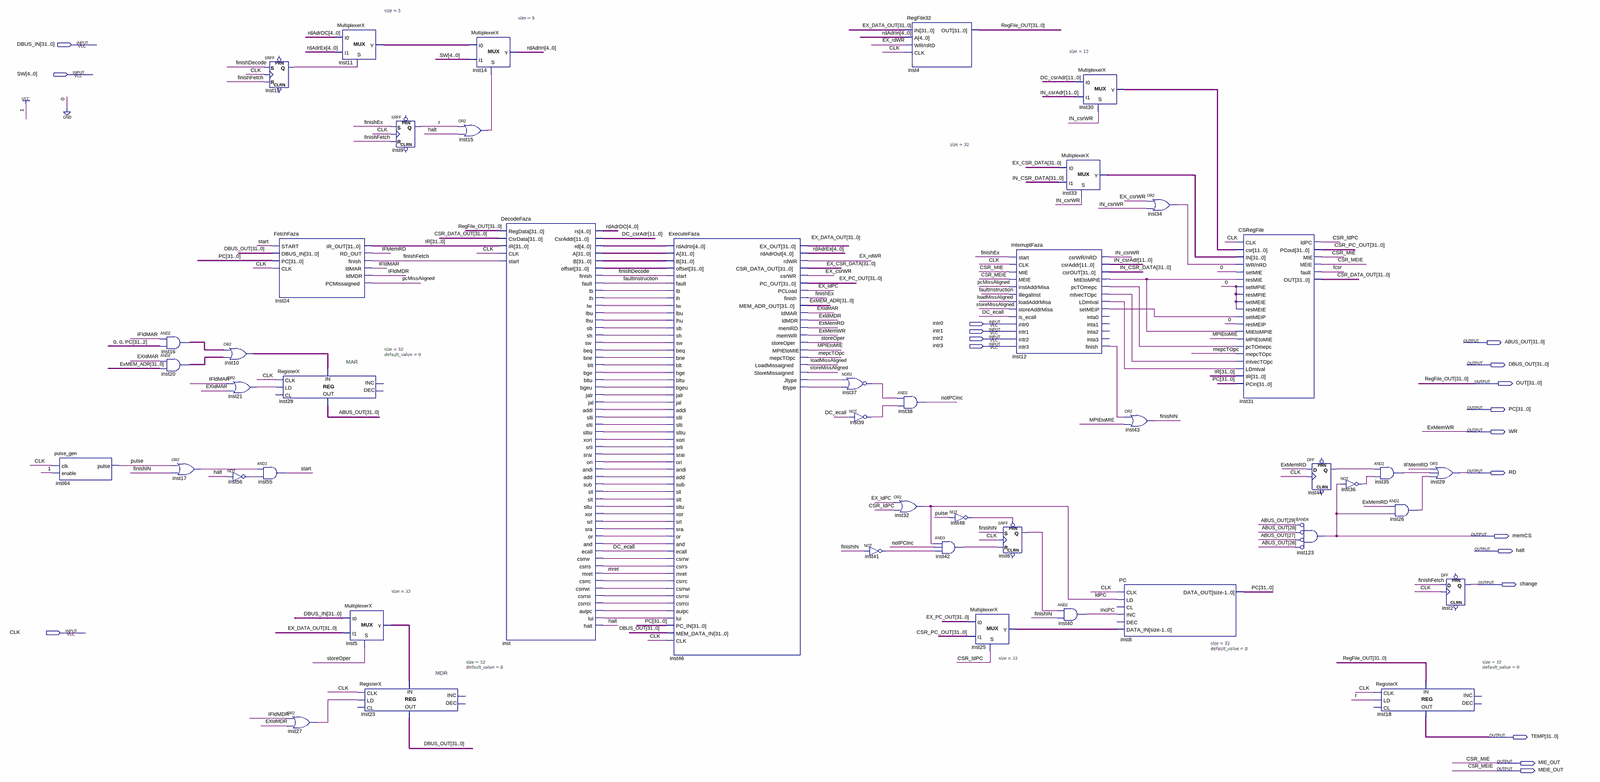
[diagram p0: schematic sheet, whole]
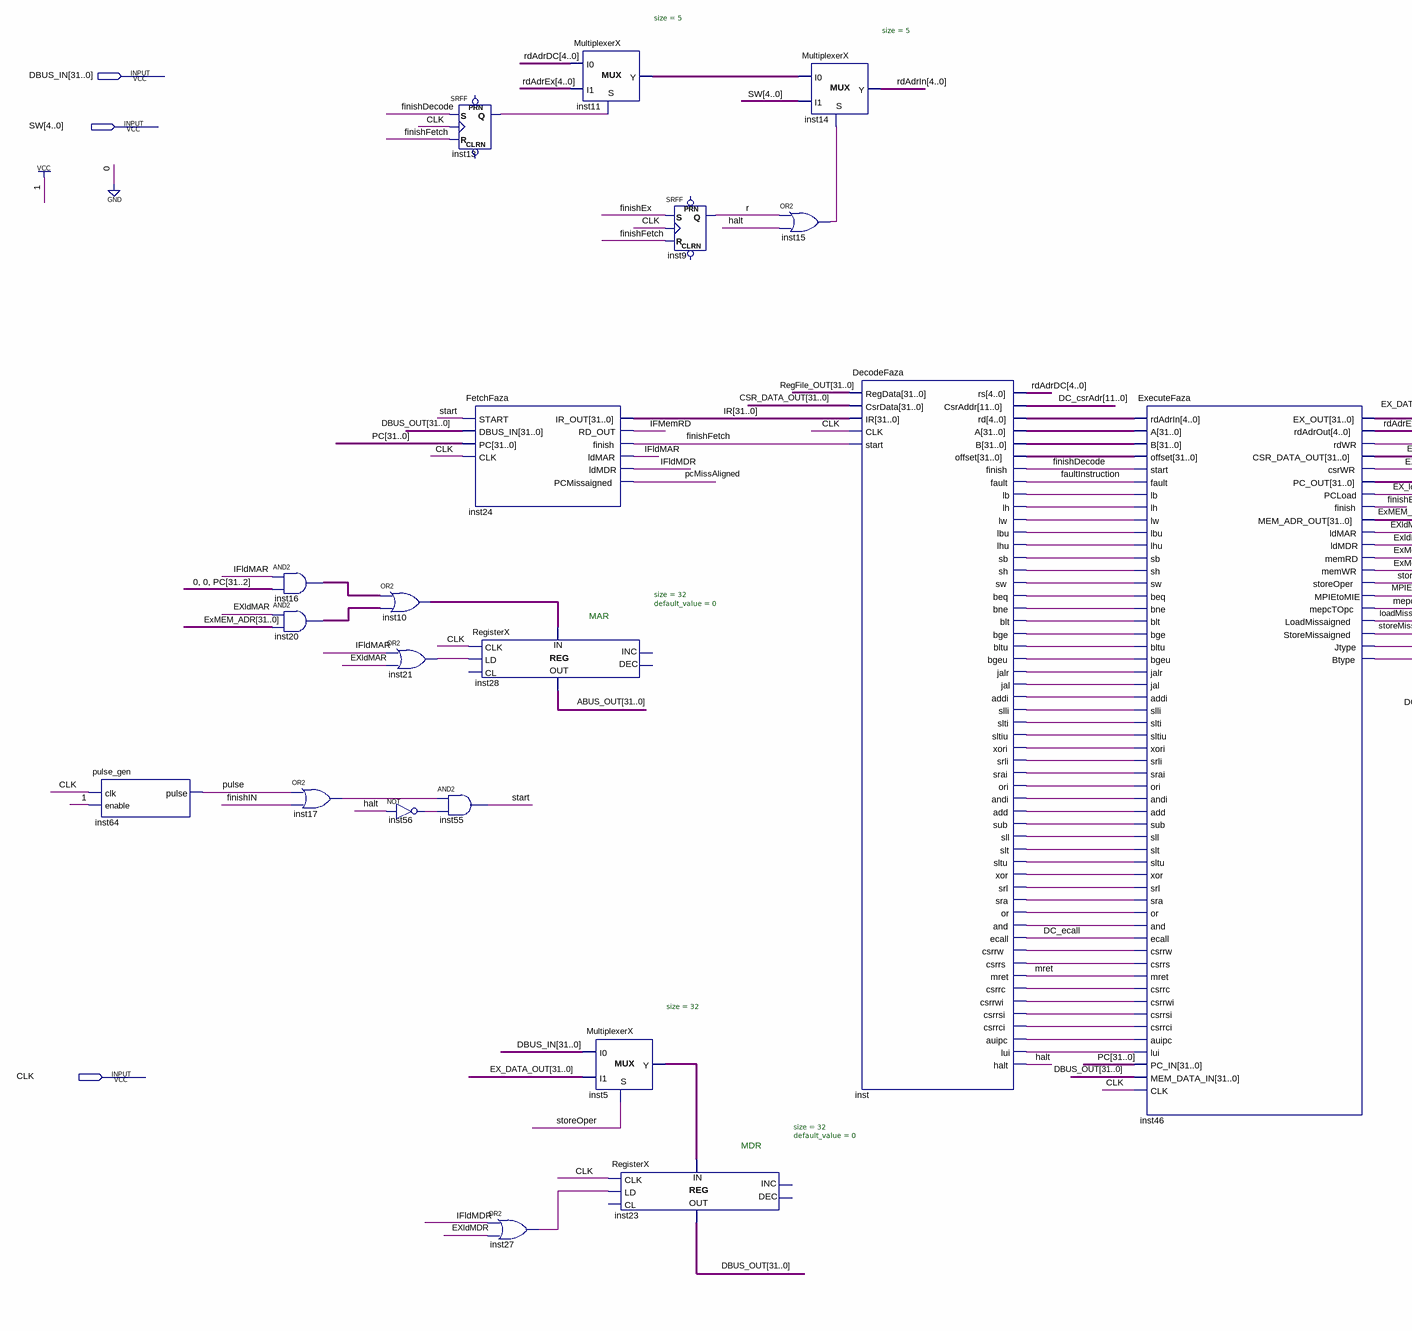
[diagram p1: schematic sheet, left part]
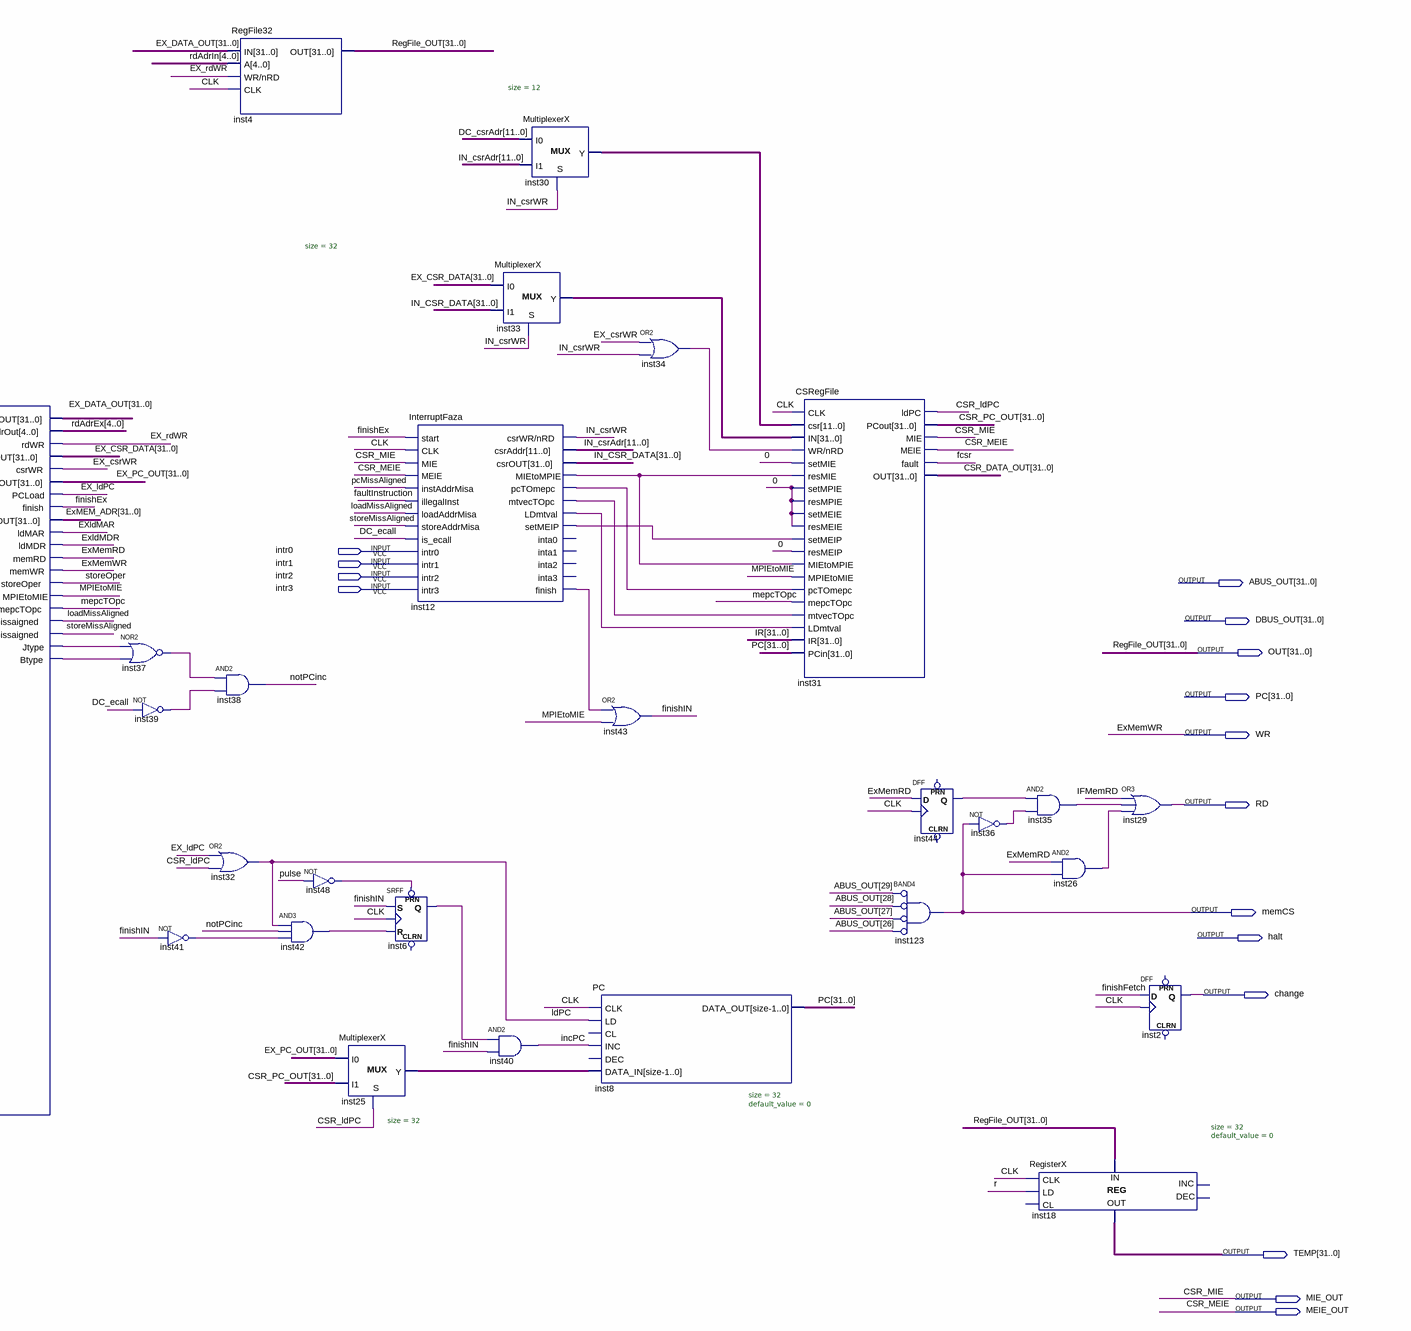
[diagram p2: schematic sheet, right part]
// Quartus schematic CPU.bdf as structural Verilog: 46 symbols, 19 pins
module CPU (
  input  [31:0] DBUS_IN,
  input  [4:0] SW,
  input  intr0,
  input  intr1,
  input  intr2,
  input  intr3,
  input  CLK,
  output [31:0] ABUS_OUT,
  output [31:0] DBUS_OUT,
  output [31:0] OUT,
  output [31:0] PC,
  output WR,
  output RD,
  output memCS,
  output halt,
  output change,
  output [31:0] TEMP,
  output MIE_OUT,
  output MEIE_OUT
);

  wire CSR_ldPC, DC_ecall, EX_csrWR, EX_ldPC, EX_rdWR, EXldMAR, EXldMDR, ExMemRD, faultInstruction, fcsr,
       finishDecode, finishEx, finishFetch, finishIN, IFldMAR, IFldMDR, IFMemRD, IN_csrWR, incPC, inst6_q,
       inst12_finish, inst12_ldmtval, inst12_mietompie, inst12_mtvectopc, inst12_pctomepc, inst12_setmeip,
       inst13_q, inst15_out, inst17_out, inst21_out, inst26_out, inst27_out, inst34_out, inst35_out,
       inst36_out, inst37_out, inst39_out, inst41_out, inst42_out, inst44_q, inst46_btype, inst46_jtype,
       inst48_out, inst56_out, inst_add, inst_addi, inst_and, inst_andi, inst_auipc, inst_beq, inst_bge,
       inst_bgeu, inst_blt, inst_bltu, inst_bne, inst_csrrc, inst_csrrci, inst_csrrs, inst_csrrsi,
       inst_csrrw, inst_csrrwi, inst_jal, inst_jalr, inst_lb, inst_lbu, inst_lh, inst_lhu, inst_lui, inst_lw,
       inst_or, inst_ori, inst_sb, inst_sh, inst_sll, inst_slli, inst_slt, inst_slti, inst_sltiu, inst_sltu,
       inst_sra, inst_srai, inst_srl, inst_srli, inst_sub, inst_sw, inst_xor, inst_xori, ldPC,
       loadMissAligned, mepcTOpc, MPIEtoMIE, mret, notPCinc, pcMissAligned, pulse, r, start,
       storeMissAligned, storeOper;
  wire [4:0] inst11_y, inst_rd, rdAdrDC, rdAdrEx, rdAdrIn;
  wire [11:0] DC_csrAdr, IN_csrAdr, inst30_y;
  wire [31:0] CSR_DATA_OUT, CSR_PC_OUT, EX_CSR_DATA, EX_DATA_OUT, EX_PC_OUT, ExMEM_ADR, IN_CSR_DATA, inst5_y,
       inst10_out, inst16_out, inst20_out, inst25_y, inst33_y, inst_a, inst_b, inst_offset, IR;

  pulse_gen inst64 (.clk(CLK), .enable(1'b1), .pulse(pulse));
  assign inst16_out = {32{IFldMAR}} & {2'b00, PC[31:2]};  // AND2 inst16, 32 bits wide
  assign inst20_out = {32{EXldMAR}} & ExMEM_ADR;  // AND2 inst20, 32 bits wide
  or inst17 (inst17_out, pulse, finishIN);
  assign inst10_out = inst16_out | inst20_out;  // OR2 inst10, 32 bits wide
  or inst21 (inst21_out, IFldMAR, EXldMAR);
  not inst56 (inst56_out, halt);
  SRFF inst13 (.S(finishDecode), .R(finishFetch), .CLK(CLK), .Q(inst13_q));  // open: PRN, CLRN
  and inst55 (start, inst17_out, inst56_out);
  FetchFaza inst24 (
    .START(start), .DBUS_IN(DBUS_OUT), .PC(PC), .CLK(CLK), .IR_OUT(IR), .RD_OUT(IFMemRD),
    .finish(finishFetch), .ldMAR(IFldMAR), .ldMDR(IFldMDR), .PCMissaigned(pcMissAligned));
  RegisterX #(.size(32), .default_value(0)) inst28 (
    .CLK(CLK), .LD(inst21_out), .DATA_IN(inst10_out), .DATA_OUT(ABUS_OUT));  // open: CL, INC, DEC
  or inst27 (inst27_out, IFldMDR, EXldMDR);
  MultiplexerX #(.size(5)) inst11 (.S(inst13_q), .I0(rdAdrDC), .I1(rdAdrEx), .Y(inst11_y));
  MultiplexerX #(.size(32)) inst5 (.S(storeOper), .I0(DBUS_IN), .I1(EX_DATA_OUT), .Y(inst5_y));
  RegisterX #(.size(32), .default_value(0)) inst23 (
    .CLK(CLK), .LD(inst27_out), .DATA_IN(inst5_y), .DATA_OUT(DBUS_OUT));  // open: CL, INC, DEC
  SRFF inst9 (.S(finishEx), .R(finishFetch), .CLK(CLK), .Q(r));  // open: PRN, CLRN
  MultiplexerX #(.size(5)) inst14 (.S(inst15_out), .I0(inst11_y), .I1(SW), .Y(rdAdrIn));
  or inst15 (inst15_out, r, halt);
  DecodeFaza inst (
    .RegData(OUT), .CsrData(CSR_DATA_OUT), .IR(IR), .CLK(CLK), .start(finishFetch), .rs(rdAdrDC),
    .CsrAddr(DC_csrAdr), .rd(inst_rd), .A(inst_a), .B(inst_b), .offset(inst_offset), .finish(finishDecode),
    .fault(faultInstruction), .lb(inst_lb), .lh(inst_lh), .lw(inst_lw), .lbu(inst_lbu), .lhu(inst_lhu),
    .sb(inst_sb), .sh(inst_sh), .sw(inst_sw), .beq(inst_beq), .bne(inst_bne), .blt(inst_blt), .bge(inst_bge),
    .bltu(inst_bltu), .bgeu(inst_bgeu), .jalr(inst_jalr), .jal(inst_jal), .addi(inst_addi), .slli(inst_slli),
    .slti(inst_slti), .sltiu(inst_sltiu), .xori(inst_xori), .srli(inst_srli), .srai(inst_srai),
    .ori(inst_ori), .andi(inst_andi), .add(inst_add), .sub(inst_sub), .sll(inst_sll), .slt(inst_slt),
    .sltu(inst_sltu), .\xor (inst_xor), .srl(inst_srl), .sra(inst_sra), .\or (inst_or), .\and (inst_and),
    .ecall(DC_ecall), .csrrw(inst_csrrw), .csrrs(inst_csrrs), .mret(mret), .csrrc(inst_csrrc),
    .csrrwi(inst_csrrwi), .csrrsi(inst_csrrsi), .csrrci(inst_csrrci), .auipc(inst_auipc), .lui(inst_lui),
    .halt(halt));
  ExecuteFaza inst46 (
    .rdAdrIn(inst_rd), .A(inst_a), .B(inst_b), .offset(inst_offset), .start(finishDecode),
    .fault(faultInstruction), .lb(inst_lb), .lh(inst_lh), .lw(inst_lw), .lbu(inst_lbu), .lhu(inst_lhu),
    .sb(inst_sb), .sh(inst_sh), .sw(inst_sw), .beq(inst_beq), .bne(inst_bne), .blt(inst_blt), .bge(inst_bge),
    .bltu(inst_bltu), .bgeu(inst_bgeu), .jalr(inst_jalr), .jal(inst_jal), .addi(inst_addi), .slli(inst_slli),
    .slti(inst_slti), .sltiu(inst_sltiu), .xori(inst_xori), .srli(inst_srli), .srai(inst_srai),
    .ori(inst_ori), .andi(inst_andi), .add(inst_add), .sub(inst_sub), .sll(inst_sll), .slt(inst_slt),
    .sltu(inst_sltu), .\xor (inst_xor), .srl(inst_srl), .sra(inst_sra), .\or (inst_or), .\and (inst_and),
    .ecall(DC_ecall), .csrrw(inst_csrrw), .csrrs(inst_csrrs), .mret(mret), .csrrc(inst_csrrc),
    .csrrwi(inst_csrrwi), .csrrsi(inst_csrrsi), .csrrci(inst_csrrci), .auipc(inst_auipc), .lui(inst_lui),
    .PC_IN(PC), .MEM_DATA_IN(DBUS_OUT), .CLK(CLK), .EX_OUT(EX_DATA_OUT), .rdAdrOut(rdAdrEx), .rdWR(EX_rdWR),
    .CSR_DATA_OUT(EX_CSR_DATA), .csrWR(EX_csrWR), .PC_OUT(EX_PC_OUT), .PCLoad(EX_ldPC), .finish(finishEx),
    .MEM_ADR_OUT(ExMEM_ADR), .ldMAR(EXldMAR), .ldMDR(EXldMDR), .memRD(ExMemRD), .memWR(WR),
    .storeOper(storeOper), .MPIEtoMIE(MPIEtoMIE), .mepcTOpc(mepcTOpc), .LoadMissaigned(loadMissAligned),
    .StoreMissaigned(storeMissAligned), .Jtype(inst46_jtype), .Btype(inst46_btype));
  nor inst37 (inst37_out, inst46_jtype, inst46_btype);
  not inst39 (inst39_out, DC_ecall);
  not inst41 (inst41_out, finishIN);
  or inst32 (ldPC, EX_ldPC, CSR_ldPC);
  RegFile32 inst4 (.IN(EX_DATA_OUT), .A(rdAdrIn), .\WR/nRD (EX_rdWR), .CLK(CLK), .OUT(OUT));
  and inst38 (notPCinc, inst37_out, inst39_out);
  not inst48 (inst48_out, pulse);
  and inst42 (inst42_out, ldPC, notPCinc, inst41_out);
  MultiplexerX #(.size(32)) inst25 (.S(CSR_ldPC), .I0(EX_PC_OUT), .I1(CSR_PC_OUT), .Y(inst25_y));
  InterruptFaza inst12 (
    .start(finishEx), .CLK(CLK), .MIE(MIE_OUT), .MEIE(MEIE_OUT), .instAddrMisa(pcMissAligned),
    .illegalInst(faultInstruction), .loadAddrMisa(loadMissAligned), .storeAddrMisa(storeMissAligned),
    .is_ecall(DC_ecall), .intr0(intr0), .intr1(intr1), .intr2(intr2), .intr3(intr3), .\csrWR/nRD (IN_csrWR),
    .csrAddr(IN_csrAdr), .csrOUT(IN_CSR_DATA), .MIEtoMPIE(inst12_mietompie), .pcTOmepc(inst12_pctomepc),
    .mtvecTOpc(inst12_mtvectopc), .LDmtval(inst12_ldmtval), .setMEIP(inst12_setmeip), .finish(inst12_finish));  // open: inta0, inta1, inta2, inta3
  SRFF inst6 (.PRN(inst48_out), .S(finishIN), .R(inst42_out), .CLK(CLK), .Q(inst6_q));  // open: CLRN
  MultiplexerX #(.size(32)) inst33 (.S(IN_csrWR), .I0(EX_CSR_DATA), .I1(IN_CSR_DATA), .Y(inst33_y));
  and inst40 (incPC, inst6_q, finishIN);
  MultiplexerX #(.size(12)) inst30 (.S(IN_csrWR), .I0(DC_csrAdr), .I1(IN_csrAdr), .Y(inst30_y));
  or inst43 (finishIN, inst12_finish, MPIEtoMIE);
  PC #(.size(32), .default_value(0)) inst8 (
    .CLK(CLK), .LD(ldPC), .INC(incPC), .DATA_IN(inst25_y), .DATA_OUT(PC));  // open: CL, DEC
  or inst34 (inst34_out, EX_csrWR, IN_csrWR);
  CSRegFile inst31 (
    .CLK(CLK), .csr(inst30_y), .IN(inst33_y), .\WR/nRD (inst34_out), .setMIE(1'b0),
    .resMIE(inst12_mietompie), .setMPIE(1'b0), .resMPIE(1'b0), .setMEIE(1'b0), .resMEIE(1'b0),
    .setMEIP(inst12_setmeip), .resMEIP(1'b0), .MIEtoMPIE(inst12_mietompie), .MPIEtoMIE(MPIEtoMIE),
    .pcTOmepc(inst12_pctomepc), .mepcTOpc(mepcTOpc), .mtvecTOpc(inst12_mtvectopc), .LDmtval(inst12_ldmtval),
    .IR(IR), .PCin(PC), .ldPC(CSR_ldPC), .PCout(CSR_PC_OUT), .MIE(MIE_OUT), .MEIE(MEIE_OUT), .fault(fcsr),
    .OUT(CSR_DATA_OUT));
  DFF inst44 (.CLK(CLK), .D(ExMemRD), .Q(inst44_q));  // open: CLRN, PRN
  and inst123 (memCS, ~ABUS_OUT[29], ~ABUS_OUT[28], ~ABUS_OUT[27], ~ABUS_OUT[26]);  // BAND4
  not inst36 (inst36_out, memCS);
  and inst35 (inst35_out, inst44_q, inst36_out);
  and inst26 (inst26_out, ExMemRD, memCS);
  RegisterX #(.size(32), .default_value(0)) inst18 (
    .CLK(CLK), .LD(r), .DATA_IN(OUT), .DATA_OUT(TEMP));  // open: CL, INC, DEC
  or inst29 (RD, IFMemRD, inst35_out, inst26_out);
  DFF inst2 (.CLK(CLK), .D(finishFetch), .Q(change));  // open: CLRN, PRN

  // Other names for the same wires on the sheet: CSR_MEIE = MEIE_OUT; CSR_MIE = MIE_OUT; ExMemWR = WR;
  //   RegFile_OUT[31:0] = OUT

  // Notes on the sheet:
  //   MAR
  //   MDR
endmodule
